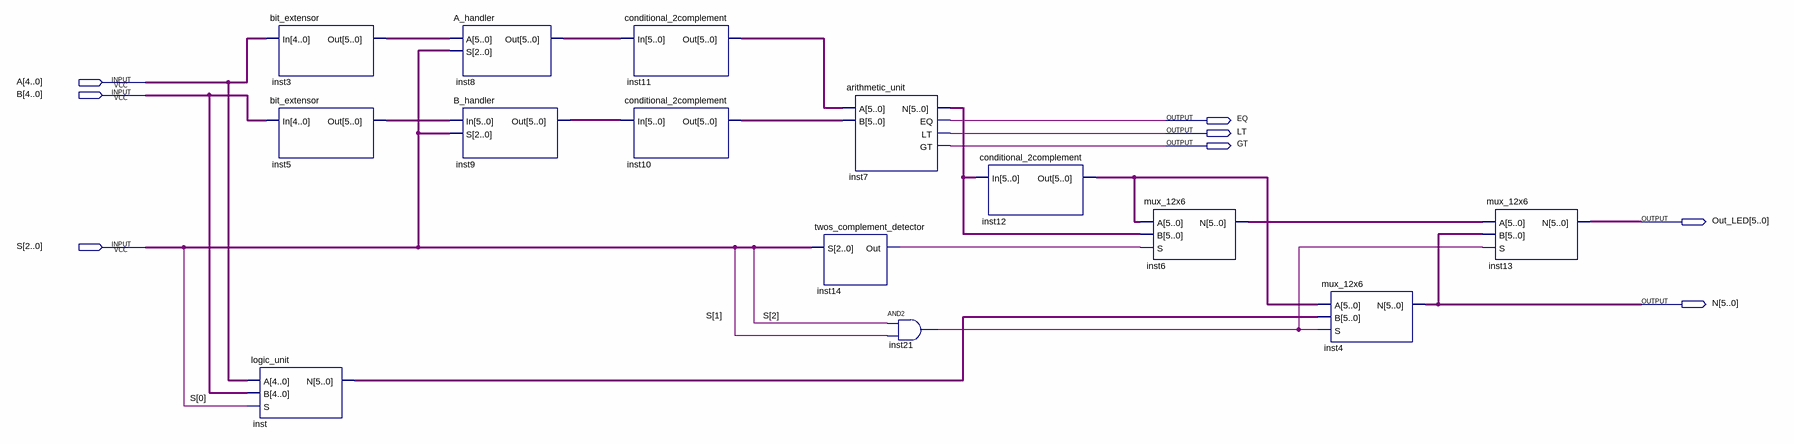
[diagram p0: schematic sheet]
// Quartus schematic ALU.bdf as structural Verilog: 14 symbols, 8 pins
module ALU (
  input  [4:0] A,
  input  [4:0] B,
  input  [2:0] S,
  output EQ,
  output LT,
  output GT,
  output [5:0] Out_LED,
  output [5:0] N
);

  wire inst14_out, inst21_out;
  wire [5:0] inst3_out, inst5_out, inst6_n, inst7_n, inst8_out, inst9_out, inst10_out, inst11_out,
       inst12_out, inst_n;

  bit_extensor inst3 (.In(A), .Out(inst3_out));
  bit_extensor inst5 (.In(B), .Out(inst5_out));
  logic_unit inst (.A(A), .B(B), .S(S[0]), .N(inst_n));
  A_handler inst8 (.A(inst3_out), .S(S), .Out(inst8_out));
  B_handler inst9 (.In(inst5_out), .S(S), .Out(inst9_out));
  conditional_2complement inst11 (.In(inst8_out), .Out(inst11_out));
  conditional_2complement inst10 (.In(inst9_out), .Out(inst10_out));
  twos_complement_detector inst14 (.S(S), .Out(inst14_out));
  arithmetic_unit inst7 (.A(inst11_out), .B(inst10_out), .N(inst7_n), .EQ(EQ), .LT(LT), .GT(GT));
  and inst21 (inst21_out, S[2], S[1]);
  conditional_2complement inst12 (.In(inst7_n), .Out(inst12_out));
  mux_12x6 inst6 (.A(inst12_out), .B(inst7_n), .S(inst14_out), .N(inst6_n));
  mux_12x6 inst4 (.A(inst12_out), .B(inst_n), .S(inst21_out), .N(N));
  mux_12x6 inst13 (.A(inst6_n), .B(N), .S(inst21_out), .N(Out_LED));
endmodule
